# EAGLE design WWVB Shield (EAGLE 5.11)
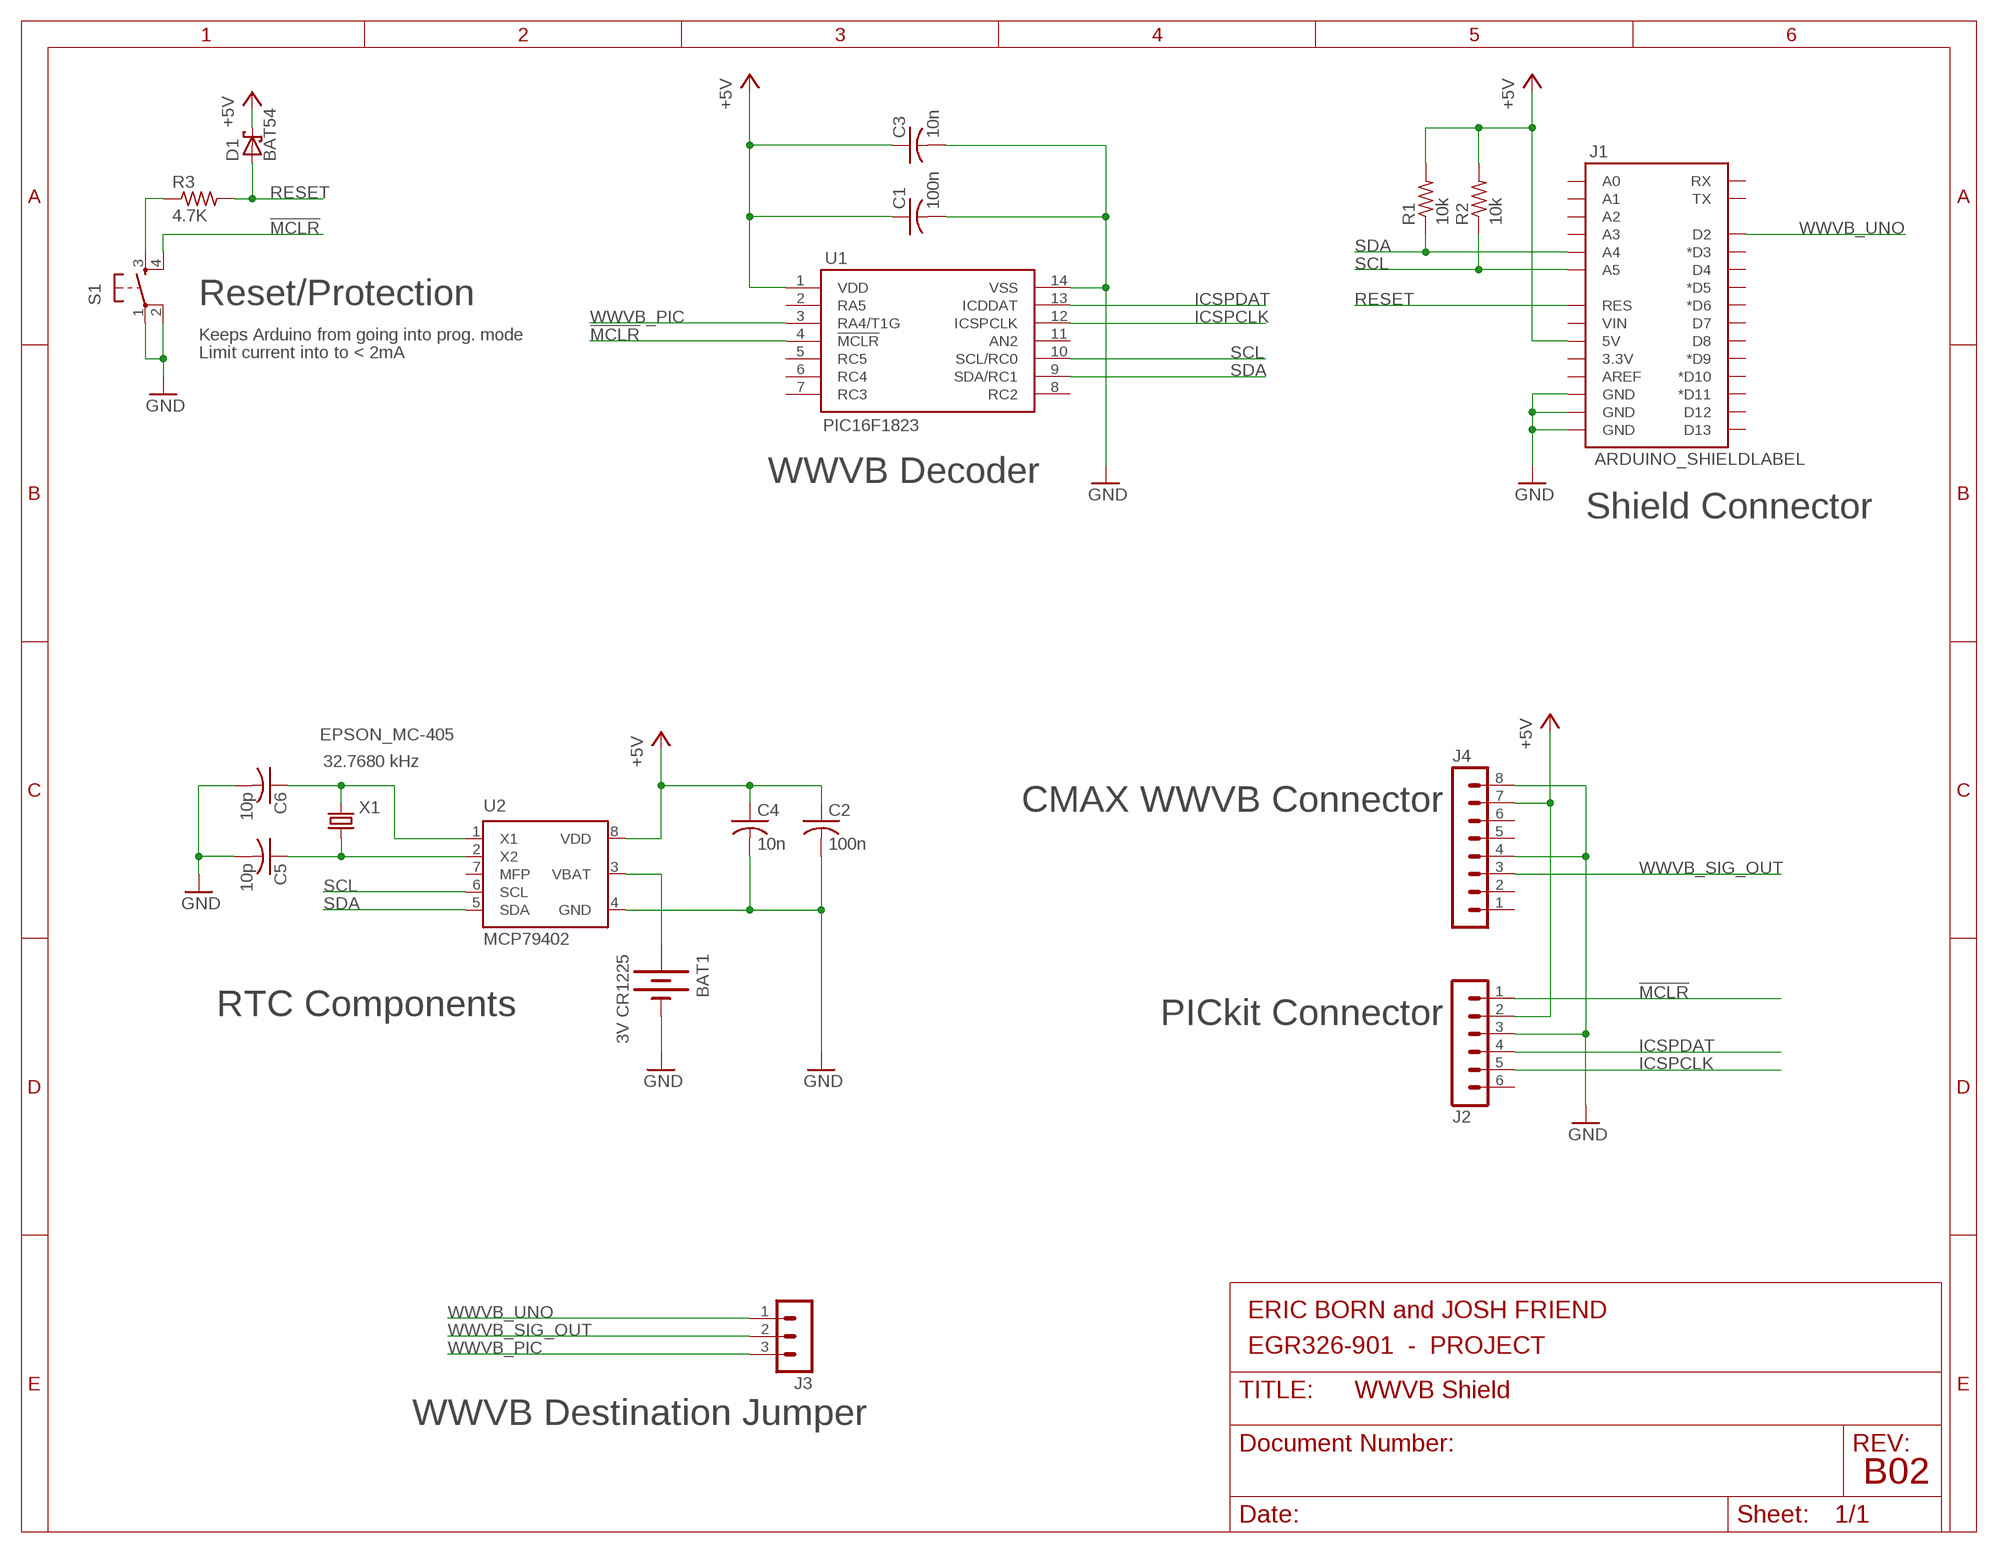
[diagram p0: schematic, sheet 1]

## Parts
BAT1  3V CR1225  BATTERY12MM  [BATTCON_12MM]
C1  100n  C-USC0805  [C0805]
C2  100n  C-USC0805  [C0805]
C3  10n  C-USC0805  [C0805]
C4  10n  C-USC0805  [C0805]
C5  10p  C-USC0805  [C0805]
C6  10p  C-USC0805  [C0805]
D1  BAT54  [SOT23]
J1  ARDUINO_SHIELDLABEL  [DUEMILANOVE_SHIELD]
J2  MA06-1  [MA06-1]
J3  MA03-1  [MA03-1]
J4  MA08-1  [MA08-1]
R1  10k  R-US_R0805  [R0805]
R2  10k  R-US_R0805  [R0805]
R3  4.7K  R-US_R0805  [R0805]
S1  TAC_SWITCHPTH  [TACTILE-PTH]
U1  PIC16F1823  [SO-14]
U2  MCP79402  MCP79410-ISN  [SO8]
X1  EPSON_MC-405  [MC405]

## Nets
!MCLR: J2.1 S1.4 U1.4(!MCLR)
+5V: C1.1 C2.1 C3.1 C4.1 D1.3(C) J1.5V J2.2 J4.7 R1.2 R2.2 U1.1(VDD) U2.8(VDD)
GND: BAT1.GND(-) C1.2 C2.2 C3.2 C4.2 C5.2 C6.2 J1.GND@0(GND) J1.GND@1(GND) J1.GND@2(GND) J2.3 J4.4 J4.8 S1.1 S1.2 U1.14(VSS) U2.4(GND)
ICSPCLK: J2.5 U1.12(ICSPCLK)
ICSPDAT: J2.4 U1.13(ICDDAT)
N$7: BAT1.PWR@1(+) U2.3(VBAT)
N$16: C5.1 U2.2(X2) X1.1
N$17: C6.1 U2.1(X1) X1.2
N$20: R3.1 S1.3
RESET: D1.1(A) J1.RES R3.2
SCL: J1.A5 R2.1 U1.10(SCL/RC0) U2.6(SCL)
SDA: J1.A4 R1.1 U1.9(SDA/RC1) U2.5(SDA)
WWVB_PIC: J3.3 U1.3(RA4/T1G)
WWVB_SIG_OUT: J3.2 J4.3
WWVB_UNO: J1.D2 J3.1
Unconnected: J1.3.3V J1.A0 J1.A1 J1.A2 J1.A3 J1.AREF J1.D3(*D3) J1.D4 J1.D5(*D5) J1.D6(*D6) J1.D7 J1.D8 J1.D9(*D9) J1.D10(*D10) J1.D11(*D11) J1.D12 J1.D13 J1.RX J1.TX J1.VIN J2.6 J4.1 J4.2 J4.5 J4.6 U1.2(RA5) U1.5(RC5) U1.6(RC4) U1.7(RC3) U1.8(RC2) U1.11(AN2) U2.7(MFP)

## Notes on the sheet
- Reset/Protection
- Keeps Arduino from going into prog. mode
- Limit current into to < 2mA
- WWVB Decoder
- Shield Connector
- 32.7680 kHz
- CMAX WWVB Connector
- PICkit Connector
- RTC Components
- ERIC BORN and JOSH FRIEND
- EGR326-901  -  PROJECT
- WWVB Destination Jumper
- B02

## Library data of the parts
BAT1 = SparkFun:BATTERY: Battery Holders Various common sizes : AA, AAA, 20mm coin cell and 12mm coin cell.
C1-C6 = resistor:C-US: CAPACITOR, American symbol
D1 = diode:BAT54: Schottky Diodes Source: Fairchild .. BAT54.pdf
J1 = SparkFun:ARDUINO_SHIELD
J2 = con-lstb:MA06-1: PIN HEADER; OC_FARNELL: unknown; OC_NEWARK: unknown
J3 = con-lstb:MA03-1: PIN HEADER; OC_FARNELL: unknown; OC_NEWARK: unknown
J4 = con-lstb:MA08-1: PIN HEADER; OC_FARNELL: unknown; OC_NEWARK: unknown
R1-R3 = resistor:R-US_: RESISTOR, American symbol
S1 = SparkFun:TAC_SWITCH: Momentary Switch Button commonly used for reset or general input. Spark Fun Electronics SKU : COM-00097
U1 = microchip:PIC16F1823
U2 = Microchip-Tim:MCP79410-ISN: Microchip Real Time Clock Calendar with 1K battery backed RAM
X1 = Microchip-Tim:EPSON_MC-405: Epson MC-405 32.768KHz Crystal

## Board
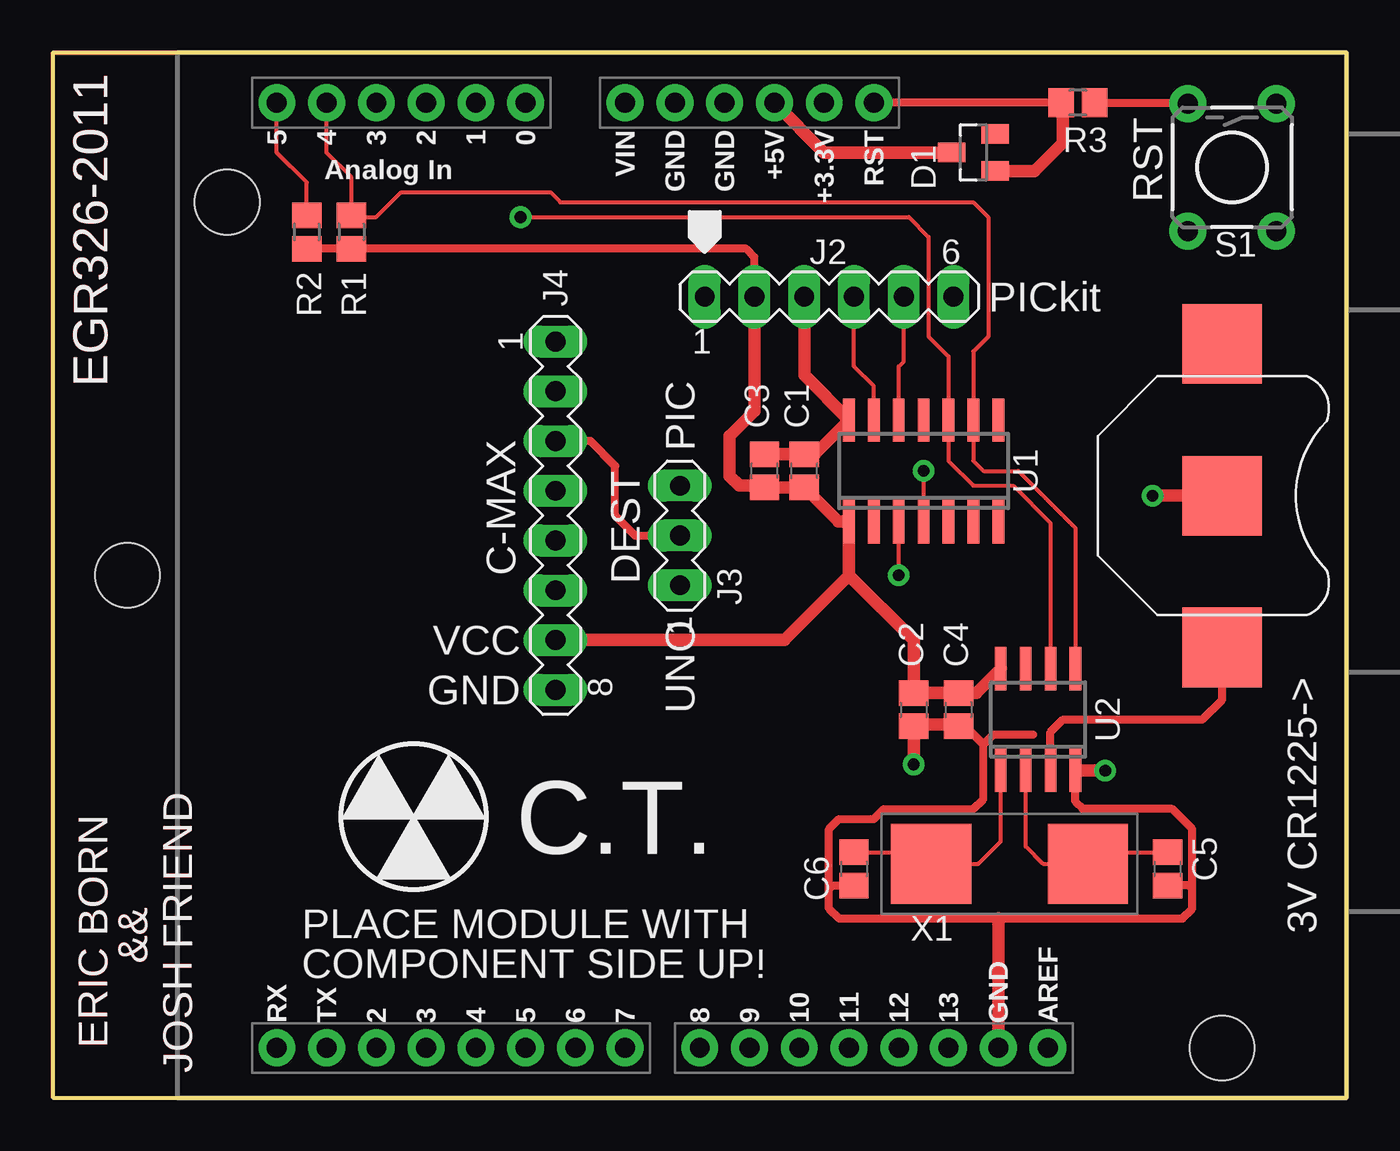
[diagram p1: board, top side]
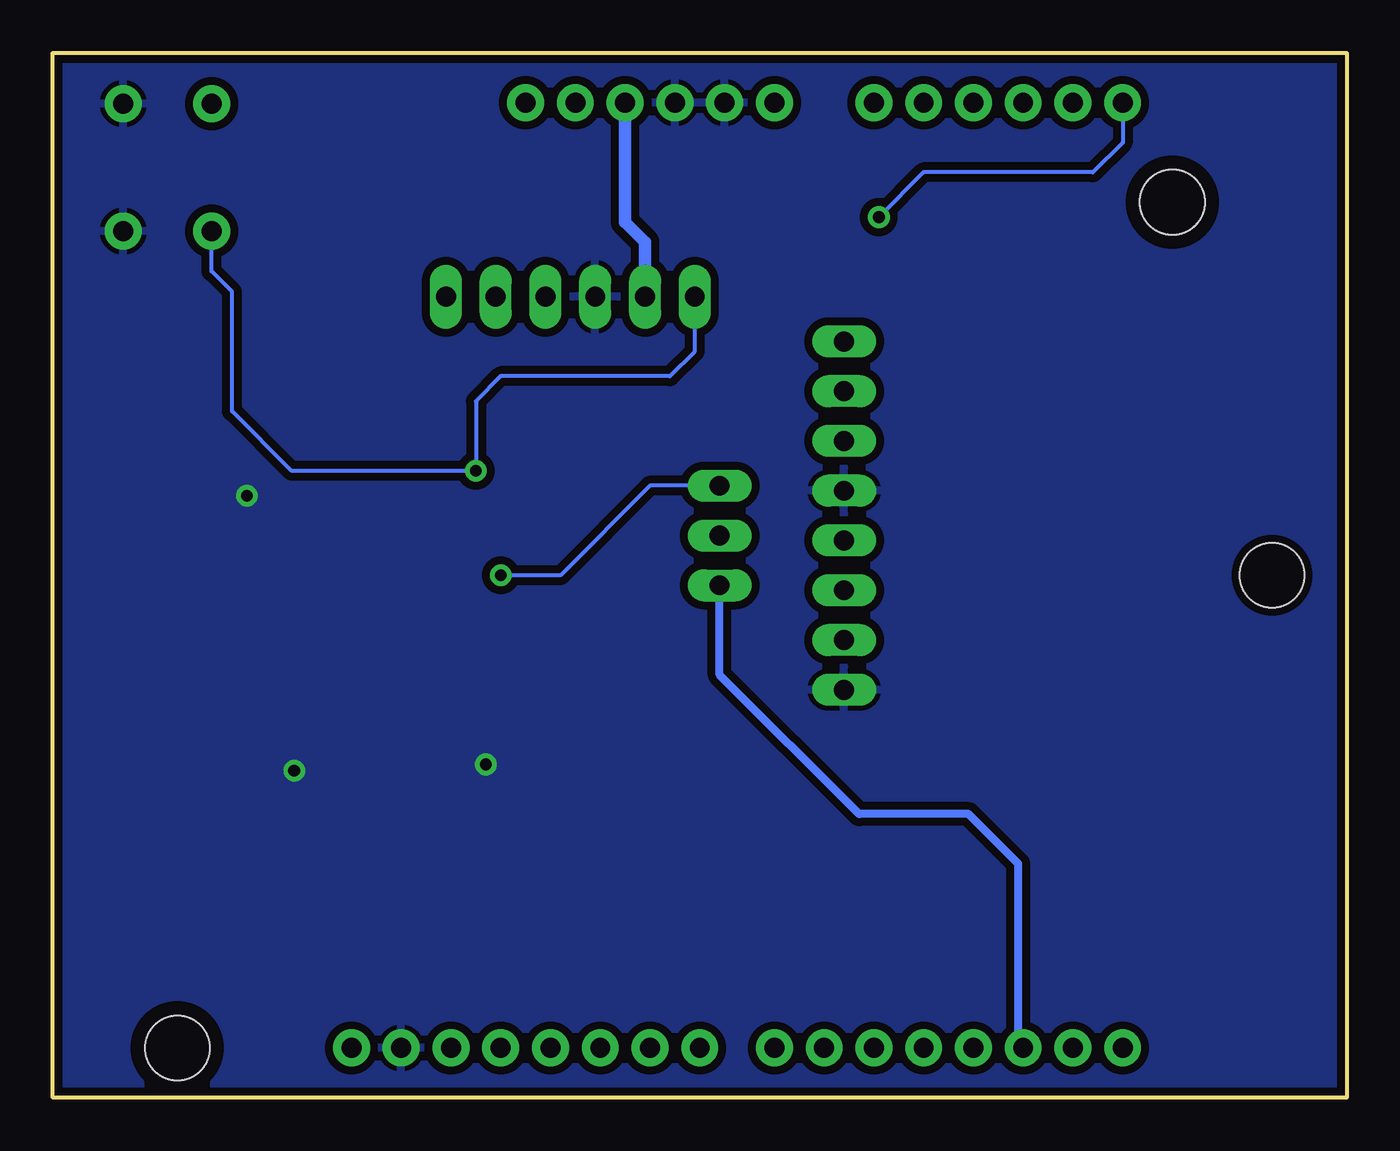
[diagram p2: board, bottom side, seen from below]

Size 66.04 x 53.34 mm. Coordinates in mm from the lower left corner, seen from the top.
Outline: 0,0 66.04,0 66.04,53.34 0,53.34 0,0
Copper layers (1*16): Top 0.035mm / dielectric 1.5mm / Bottom 0.035mm
Design rules "DesignRules": minimum track width 8mil, minimum drill 20mil, track to track 8mil, track to pad 8mil, pad to pad 8mil, via to via 8mil, smd to smd 8mil, copper to edge 10mil, drill to drill 8mil, minimum pad ring 12mil, minimum via ring 10mil, stop-mask expansion 4mil, vias tented up to drill 0mil, thermal gap 10mil
Holes 3.3 mm at 3.81,26.67

### Footprints (pad centres in the part's own frame; a part is rotated, then mirrored left to right if it is on the bottom)
BATTCON_12MM = smd 4.064 x 4.064: GND 0,0; PWR@1 7.747,0; PWR@2 -7.747,0
C0805 = smd 1.3 x 1.5: 1 -0.85,0; 2 0.85,0
SOT23 = smd 1 x 1.4: 1 -0.95,-1.1; 2 0.95,-1.1; 3 0,1.1
DUEMILANOVE_SHIELD = drill 1.016 pad 1.88 round: 3.3V 50.8,26.67; 5V 50.8,29.21; A0 50.8,41.91; A1 50.8,44.45; A2 50.8,46.99; A3 50.8,49.53; A4 50.8,52.07; A5 50.8,54.61; AREF 2.54,15.24; D2 2.54,49.53; D3 2.54,46.99; D4 2.54,44.45; D5 2.54,41.91; D6 2.54,39.37; D7 2.54,36.83; D8 2.54,33.02; D9 2.54,30.48; D10 2.54,27.94; D11 2.54,25.4; D12 2.54,22.86; D13 2.54,20.32; GND@0 50.8,31.75; GND@1 50.8,34.29; GND@2 2.54,17.78; RES 50.8,24.13; RX 2.54,54.61; TX 2.54,52.07; VIN 50.8,36.83 | hole 3.302: 45.72,57.15; 2.54,6.35
MA06-1 = drill 1.016 long: 1 -6.35,0; 2 -3.81,0; 3 -1.27,0; 4 1.27,0; 5 3.81,0; 6 6.35,0
MA03-1 = drill 1.016 long: 1 -2.54,0; 2 0,0; 3 2.54,0
MA08-1 = drill 1.016 long: 1 -8.89,0; 2 -6.35,0; 3 -3.81,0; 4 -1.27,0; 5 1.27,0; 6 3.81,0; 7 6.35,0; 8 8.89,0
R0805 = smd 1.3 x 1.5: 1 -0.85,0; 2 0.85,0
TACTILE-PTH = drill 1.016 pad 1.88 round: 1 -3.251,2.261; 2 3.251,2.261; 3 -3.251,-2.261; 4 3.251,-2.261
SO-14 = smd 0.6 x 2.2: 1 -3.81,-2.6; 2 -2.54,-2.6; 3 -1.27,-2.6; 4 0,-2.6; 5 1.27,-2.6; 6 2.54,-2.6; 7 3.81,-2.6; 8 3.81,2.6; 9 2.54,2.6; 10 1.27,2.6; 11 0,2.6; 12 -1.27,2.6; 13 -2.54,2.6; 14 -3.81,2.6
SO8 = smd 0.6 x 2.2: 1 -1.905,-2.6; 2 -0.635,-2.6; 3 0.635,-2.6; 4 1.905,-2.6; 5 1.905,2.6; 6 0.635,2.6; 7 -0.635,2.6; 8 -1.905,2.6
MC405 = smd 4.1 x 4.1: 1 -3.81,0; 2 4.191,0

### Placement (x,y rotation side)
BAT1  59.69,30.73 270 top
C1  38.35,32 90 top
C2  43.94,19.81 270 top
C3  36.32,32 90 top
C4  46.23,19.81 270 top
C5  56.9,11.68 270 top
C6  40.89,11.68 270 top
D1  46.99,48.26 90 top
J1  66.04,0 90 top
J2  39.62,40.89 0 top
J3  32,28.7 90 top
J4  25.65,29.72 270 top
R1  15.24,44.2 270 top
R2  12.95,44.2 270 top
R3  52.32,50.8 180 top
S1  60.2,47.5 270 top
U1  44.45,32 0 top
U2  50.29,19.3 0 top
U$1  [CHRONOTOMIC_LOGO]  16.51,11.18 0 top
X1  49.02,11.94 180 top

### Tracks (layer width: path | path; a pad name or v marks a point on that pad's centre or on a via)
!MCLR  (via drill 0.6)
  Top 0.203: v44.45,32 U1.4
  Bottom 0.203: S1.4 57.94,42.19 56.9,41.15 56.9,35.05 53.85,32 v44.45,32 44.45,35.56 43.18,36.83 34.54,36.83 33.27,38.1 J2.1
+5V
  Top 0.406: R2.2 R1.2 35.39,43.35 35.81,42.93 J2.2
  Top 0.635: C2.1 C4.1 47.15,20.66 U2.8 | C2.1 43.94,23.37 40.64,26.67 | 40.64,26.67 U1.1 40.1,29.4 C1.1 C3.1 36.23,31.24 35.05,31.24 34.54,31.75 34.54,33.78 35.81,35.05 J2.2 | D1.3 39.37,48.26 J1.5V | C2.1 43.78,20.83 | J4.7 37.34,23.37 40.64,26.67
  Bottom 0.635: J1.5V 36.83,44.7 35.81,43.69 J2.2
GND  (via drill 0.6)
  Top 0.406: U2.4 52.2,15.11 52.58,14.73 57.15,14.73 58.17,13.72 58.17,10.67 | 58.17,10.67 58.17,9.65 57.66,9.14 48.26,9.14 40.13,9.14 39.62,9.65 39.62,10.67 | 39.62,10.67 39.62,13.72 40.13,14.22 41.91,14.22 42.42,14.73 46.99,14.73 47.5,15.24 47.5,18.03 | C5.2 58,10.83 58.17,10.67 | C6.2 39.79,10.83 39.62,10.67 | 47.5,18.03 48.01,18.54 50.04,18.54 | C4.2 46.57,18.96 47.5,18.03
  Top 0.635: U2.4 v53.72,16.7 | 48.26,9.14 J1.GND@2 | v56.13,30.73 BAT1.GND | C2.2 v43.94,17.02 43.94,19.05 46.14,19.05 C4.2 | C3.2 C1.2 38.89,32.85 U1.14 38.35,36.89 J2.3
  pour Bottom (isolate 0.406): 0,0 66.04,0 66.04,53.34 0,53.34
ICSPCLK
  Top 0.203: U1.12 43.18,37.34 43.43,37.59 J2.5
ICSPDAT
  Top 0.203: U1.13 41.91,36.32 40.89,37.34 J2.4
N$1
  Top 0.203: 0,0 66.04,0 66.04,53.34 0,53.34 0,0
N$7
  Top 0.406: U2.3 50.93,18.67 51.56,19.3 58.67,19.3 59.69,20.32 BAT1.PWR@1
N$16
  Top 0.203: U2.2 49.66,12.83 50.55,11.94 X1.1 53.43,12.53 C5.1
N$17
  Top 0.203: U2.1 48.39,13.08 47.24,11.94 X1.2 44.23,12.53 C6.1
N$20
  Top 0.406: R3.1 57.89,50.8 S1.3
RESET
  Top 0.406: R3.2 J1.RES
  Top 0.635: D1.1 50.1,47.31 51.56,48.77 51.56,50.71 R3.2
SCL  (via drill 0.6)
  Top 0.203: U2.6 50.93,29.34 49.02,31.24 46.99,31.24 45.72,32.51 U1.10 45.72,37.85 44.7,38.86 44.7,43.94 43.69,44.96 v23.88,44.96 | R2.1 12.95,46.74 11.43,48.26 J1.A5
  Bottom 0.203: J1.A5 11.43,48.77 12.95,47.24 21.59,47.24 v23.88,44.96
SDA
  Top 0.203: U2.5 52.2,29.08 49.28,32 47.5,32 46.99,32.51 U1.9 46.99,38.1 47.75,38.86 47.75,44.96 46.99,45.72 25.91,45.72 25.4,46.23 17.78,46.23 16.51,44.96 15.33,44.96 R1.1 15.24,46.99 13.97,48.26 J1.A4
WWVB_PIC  (via drill 0.6)
  Top 0.203: v43.18,26.67 U1.3
  Bottom 0.203: v43.18,26.67 40.13,26.67 35.56,31.24 J3.3
WWVB_SIG_OUT
  Top 0.406: J4.3 27.43,33.53 28.7,32.26 28.7,29.72 29.72,28.7 J3.2
WWVB_UNO
  Bottom 0.406: J3.1 32,21.59 24.89,14.48 19.3,14.48 16.76,11.94 16.76,2.79 J1.D2

### Text on the board
Top: EGR326-2011 | && | ERIC BORN | JOSH FRIEND
tNames: EGR326-2011 | RST | PICkit | PIC | DEST | C-MAX | VCC | UNO | GND | PLACE MODULE WITH | 3V CR1225-> | && | COMPONENT SIDE UP! | ERIC BORN | JOSH FRIEND